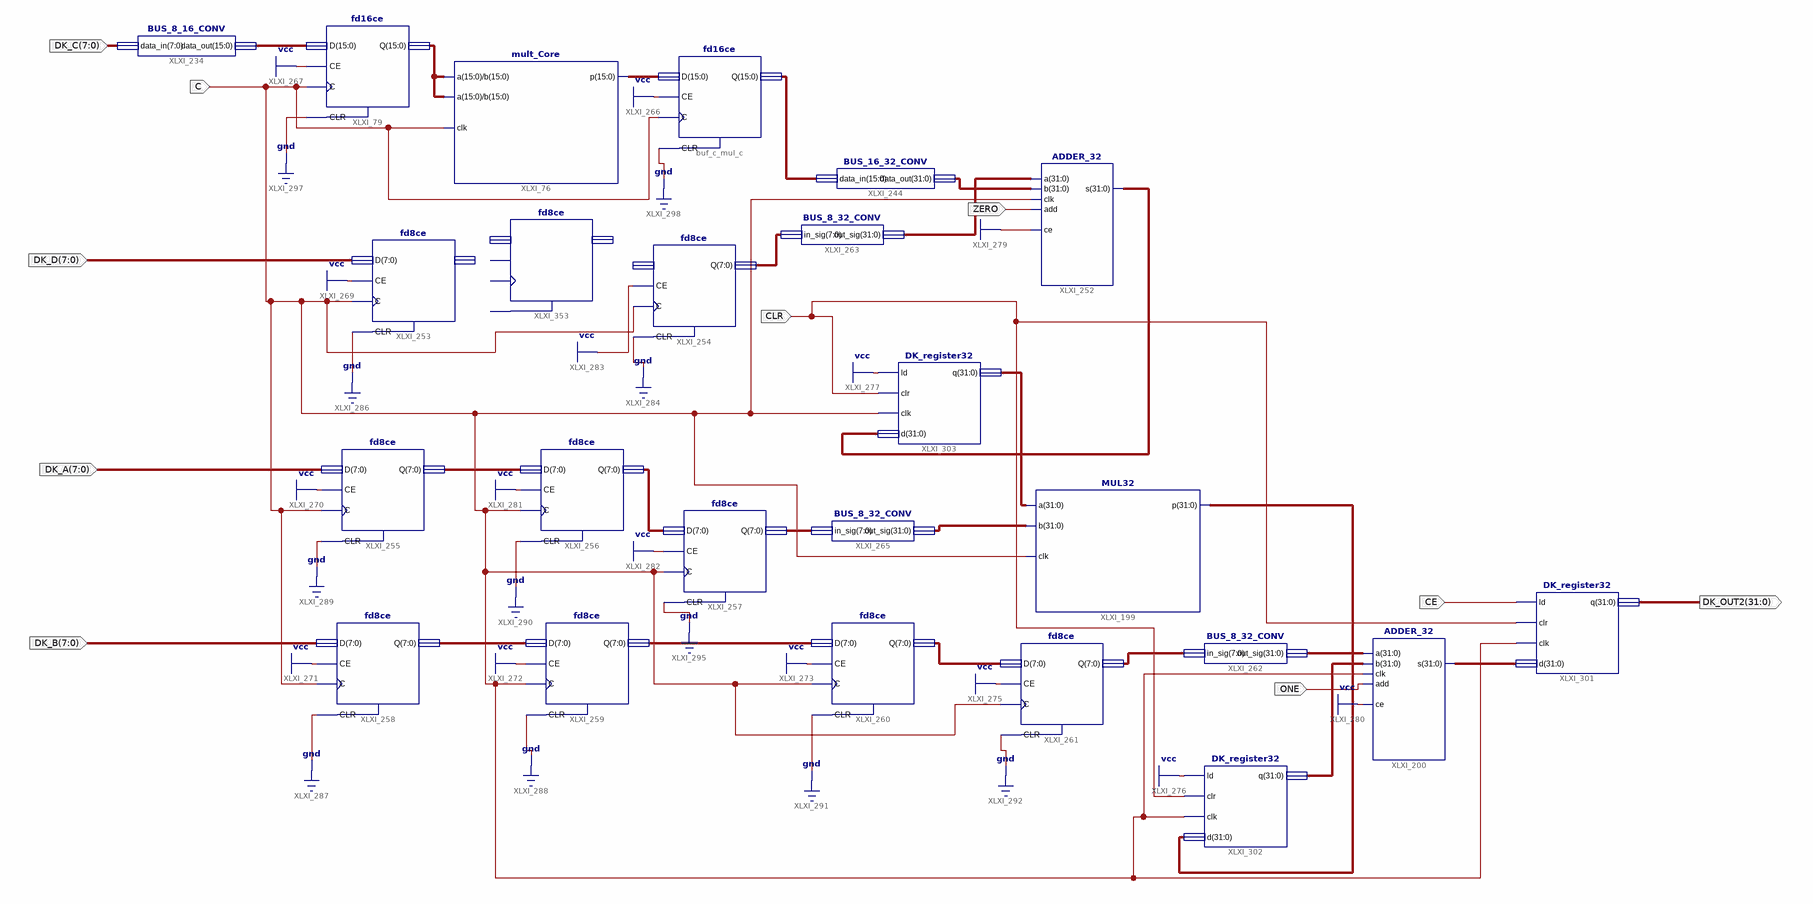
[diagram p0: schematic sheet 1]
// Xilinx ISE schematic DK_Conv_Scheme.sch (virtex7) as structural Verilog: 24 symbols, 10 ports
module DK_Conv_Scheme (
  input  ONE,
  input  [7:0] DK_C,
  input  [7:0] DK_D,
  input  [7:0] DK_A,
  input  [7:0] DK_B,
  input  ZERO,
  input  C,
  input  CE,
  input  CLR,
  output [31:0] DK_OUT2
);

  wire [7:0] buf_A_stage1, buf_A_stage2, buf_A_stage3, buf_B_stage1, buf_B_stage2, buf_B_stage3,
       buf_B_stage4, from_buf_to_sub_D;
  wire [15:0] buf_C_stage0, c_mul_c, from_buf_to_sub_C, from_mul_one_to_buf;
  wire [31:0] ADDER_A, ADDER_B, ADDER_OUT, MUL2_A, MUL2_B, MUL2_OUT, SUB_A, SUB_B, SUB_OUT;

  ADDER_32 XLXI_200 (.a(ADDER_A), .b(ADDER_B), .clk(C), .add(ONE), .ce(1'b1), .s(ADDER_OUT));
  MUL32 XLXI_199 (.a(MUL2_A), .b(MUL2_B), .clk(C), .p(MUL2_OUT));
  BUS_16_32_CONV XLXI_244 (.data_in(from_buf_to_sub_C), .data_out(SUB_A));
  ADDER_32 XLXI_252 (.a(SUB_B), .b(SUB_A), .clk(C), .add(ZERO), .ce(1'b1), .s(SUB_OUT));
  fd16ce XLXI_79 (.C(C), .CE(1'b1), .CLR(1'b0), .D(buf_C_stage0), .Q(c_mul_c));
  BUS_8_16_CONV XLXI_234 (.data_in(DK_C), .data_out(buf_C_stage0));
  fd8ce XLXI_255 (.C(C), .CE(1'b1), .CLR(1'b0), .D(DK_A), .Q(buf_A_stage1));
  fd8ce XLXI_256 (.C(C), .CE(1'b1), .CLR(1'b0), .D(buf_A_stage1), .Q(buf_A_stage2));
  fd8ce XLXI_257 (.C(C), .CE(1'b1), .CLR(1'b0), .D(buf_A_stage2), .Q(buf_A_stage3));
  fd8ce XLXI_258 (.C(C), .CE(1'b1), .CLR(1'b0), .D(DK_B), .Q(buf_B_stage1));
  fd8ce XLXI_259 (.C(C), .CE(1'b1), .CLR(1'b0), .D(buf_B_stage1), .Q(buf_B_stage2));
  fd8ce XLXI_260 (.C(C), .CE(1'b1), .CLR(1'b0), .D(buf_B_stage2), .Q(buf_B_stage3));
  fd8ce XLXI_261 (.C(C), .CE(1'b1), .CLR(1'b0), .D(buf_B_stage3), .Q(buf_B_stage4));
  BUS_8_32_CONV XLXI_262 (.in_sig(buf_B_stage4), .out_sig(ADDER_A));
  BUS_8_32_CONV XLXI_263 (.in_sig(from_buf_to_sub_D), .out_sig(SUB_B));
  BUS_8_32_CONV XLXI_265 (.in_sig(buf_A_stage3), .out_sig(MUL2_B));
  mult_Core XLXI_76 (.a(c_mul_c), .b(c_mul_c), .clk(C), .p(from_mul_one_to_buf));
  fd16ce buf_c_mul_c (.C(C), .CE(1'b1), .CLR(1'b0), .D(from_mul_one_to_buf), .Q(from_buf_to_sub_C));
  fd8ce XLXI_253 (.C(C), .CE(1'b1), .CLR(1'b0), .D(DK_D));  // open: Q
  DK_register32 XLXI_301 (.ld(CE), .clr(CLR), .clk(C), .d(ADDER_OUT), .q(DK_OUT2));
  DK_register32 XLXI_302 (.ld(1'b1), .clr(CLR), .clk(C), .d(MUL2_OUT), .q(ADDER_B));
  DK_register32 XLXI_303 (.ld(1'b1), .clr(CLR), .clk(C), .d(SUB_OUT), .q(MUL2_A));
  fd8ce XLXI_254 (.C(C), .CE(1'b1), .CLR(1'b0), .Q(from_buf_to_sub_D));  // open: D
  fd8ce XLXI_353 ();  // open: C, CE, CLR, D, Q
endmodule
